# Altium project RK3576J-MB.PrjPCB (part 5 of 7)

## Sheet VIDEO.SchDoc
size 420 x 297 mm; SheetNumber: 18; SheetTotal: 32; DocumentTypeShort: Э3; DocumentInvertoryNumber: ㅤ
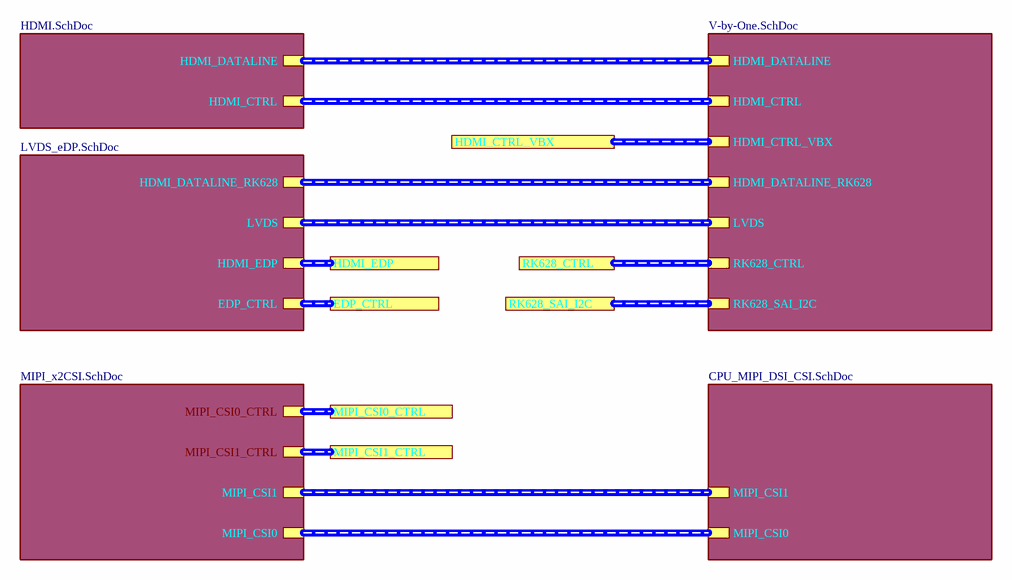
[diagram p14: VIDEO.SchDoc]

### Sub-sheets
CPU_MIPI_DSI_CSI = CPU_MIPI_DSI_CSI.SchDoc (file not in this document): MIPI_CSI1 (harness MIPI_CSI1), MIPI_CSI0 (harness MIPI_CSI0)
HDMI = HDMI.SchDoc: HDMI_DATALINE (harness HDMI_DATALINE), HDMI_CTRL (harness HDMI_CTRL)
LVDS_eDP = LVDS_eDP.SchDoc (file not in this document): LVDS (harness LVDS), HDMI_DATALINE_RK628 (harness HDMI_DATALINE_RK628), HDMI_EDP (harness HDMI_EDP), EDP_CTRL (harness EDP_CTRL)
MIPI_x2CSI = MIPI_x2CSI.SchDoc (file not in this document): MIPI_CSI1 (harness MIPI_CSI1), MIPI_CSI0 (harness MIPI_CSI0), MIPI_CSI0_CTRL (harness MIPI_CSI0_CTRL), MIPI_CSI1_CTRL (harness MIPI_CSI1_CTRL)
V-by-One.Sch = V-by-One.SchDoc (file not in this document): HDMI_CTRL (harness HDMI_CTRL), HDMI_DATALINE (harness HDMI_DATALINE), HDMI_CTRL_VBX (harness HDMI_CTRL_VBX), LVDS (harness LVDS), HDMI_DATALINE_RK628 (harness HDMI_DATALINE_RK628), RK628_SAI_I2C (harness RK628_SAI_I2C), RK628_CTRL (harness RK628_CTRL)

### Ports
EDP_CTRL, HDMI_CTRL_VBX, HDMI_EDP, MIPI_CSI0_CTRL, MIPI_CSI1_CTRL, RK628_CTRL, RK628_SAI_I2C

### Buses and harness runs
harness port EDP_CTRL = sheet LVDS_eDP/EDP_CTRL
harness port HDMI_CTRL_VBX = sheet V-by-One.Sch/HDMI_CTRL_VBX
harness port HDMI_EDP = sheet LVDS_eDP/HDMI_EDP
harness port MIPI_CSI0_CTRL = sheet MIPI_x2CSI/MIPI_CSI0_CTRL
harness port MIPI_CSI1_CTRL = sheet MIPI_x2CSI/MIPI_CSI1_CTRL
harness port RK628_CTRL = sheet V-by-One.Sch/RK628_CTRL
harness port RK628_SAI_I2C = sheet V-by-One.Sch/RK628_SAI_I2C
harness sheet CPU_MIPI_DSI_CSI/MIPI_CSI0 = sheet MIPI_x2CSI/MIPI_CSI0
harness sheet CPU_MIPI_DSI_CSI/MIPI_CSI1 = sheet MIPI_x2CSI/MIPI_CSI1
harness sheet HDMI/HDMI_CTRL = sheet V-by-One.Sch/HDMI_CTRL
harness sheet HDMI/HDMI_DATALINE = sheet V-by-One.Sch/HDMI_DATALINE
harness sheet LVDS_eDP/HDMI_DATALINE_RK628 = sheet V-by-One.Sch/HDMI_DATALINE_RK628
harness sheet LVDS_eDP/LVDS = sheet V-by-One.Sch/LVDS

### Notes on the sheet
- Подп. и дата
- Инв. № дубл.
- Взам. инв. №
- Инв. № подл.
- Изм.
- Лист
- № докум.
- Подп.
- Дата
- Копировал
- Формат А3

## Sheet HDMI.SchDoc
size 420 x 297 mm; Scale: 1:1; DocumentType: Схема электрическая принципиальная; SheetNumber: 19; SheetTotal: 32; DocumentTypeShort: Э3; DocumentInvertoryNumber: ㅤ
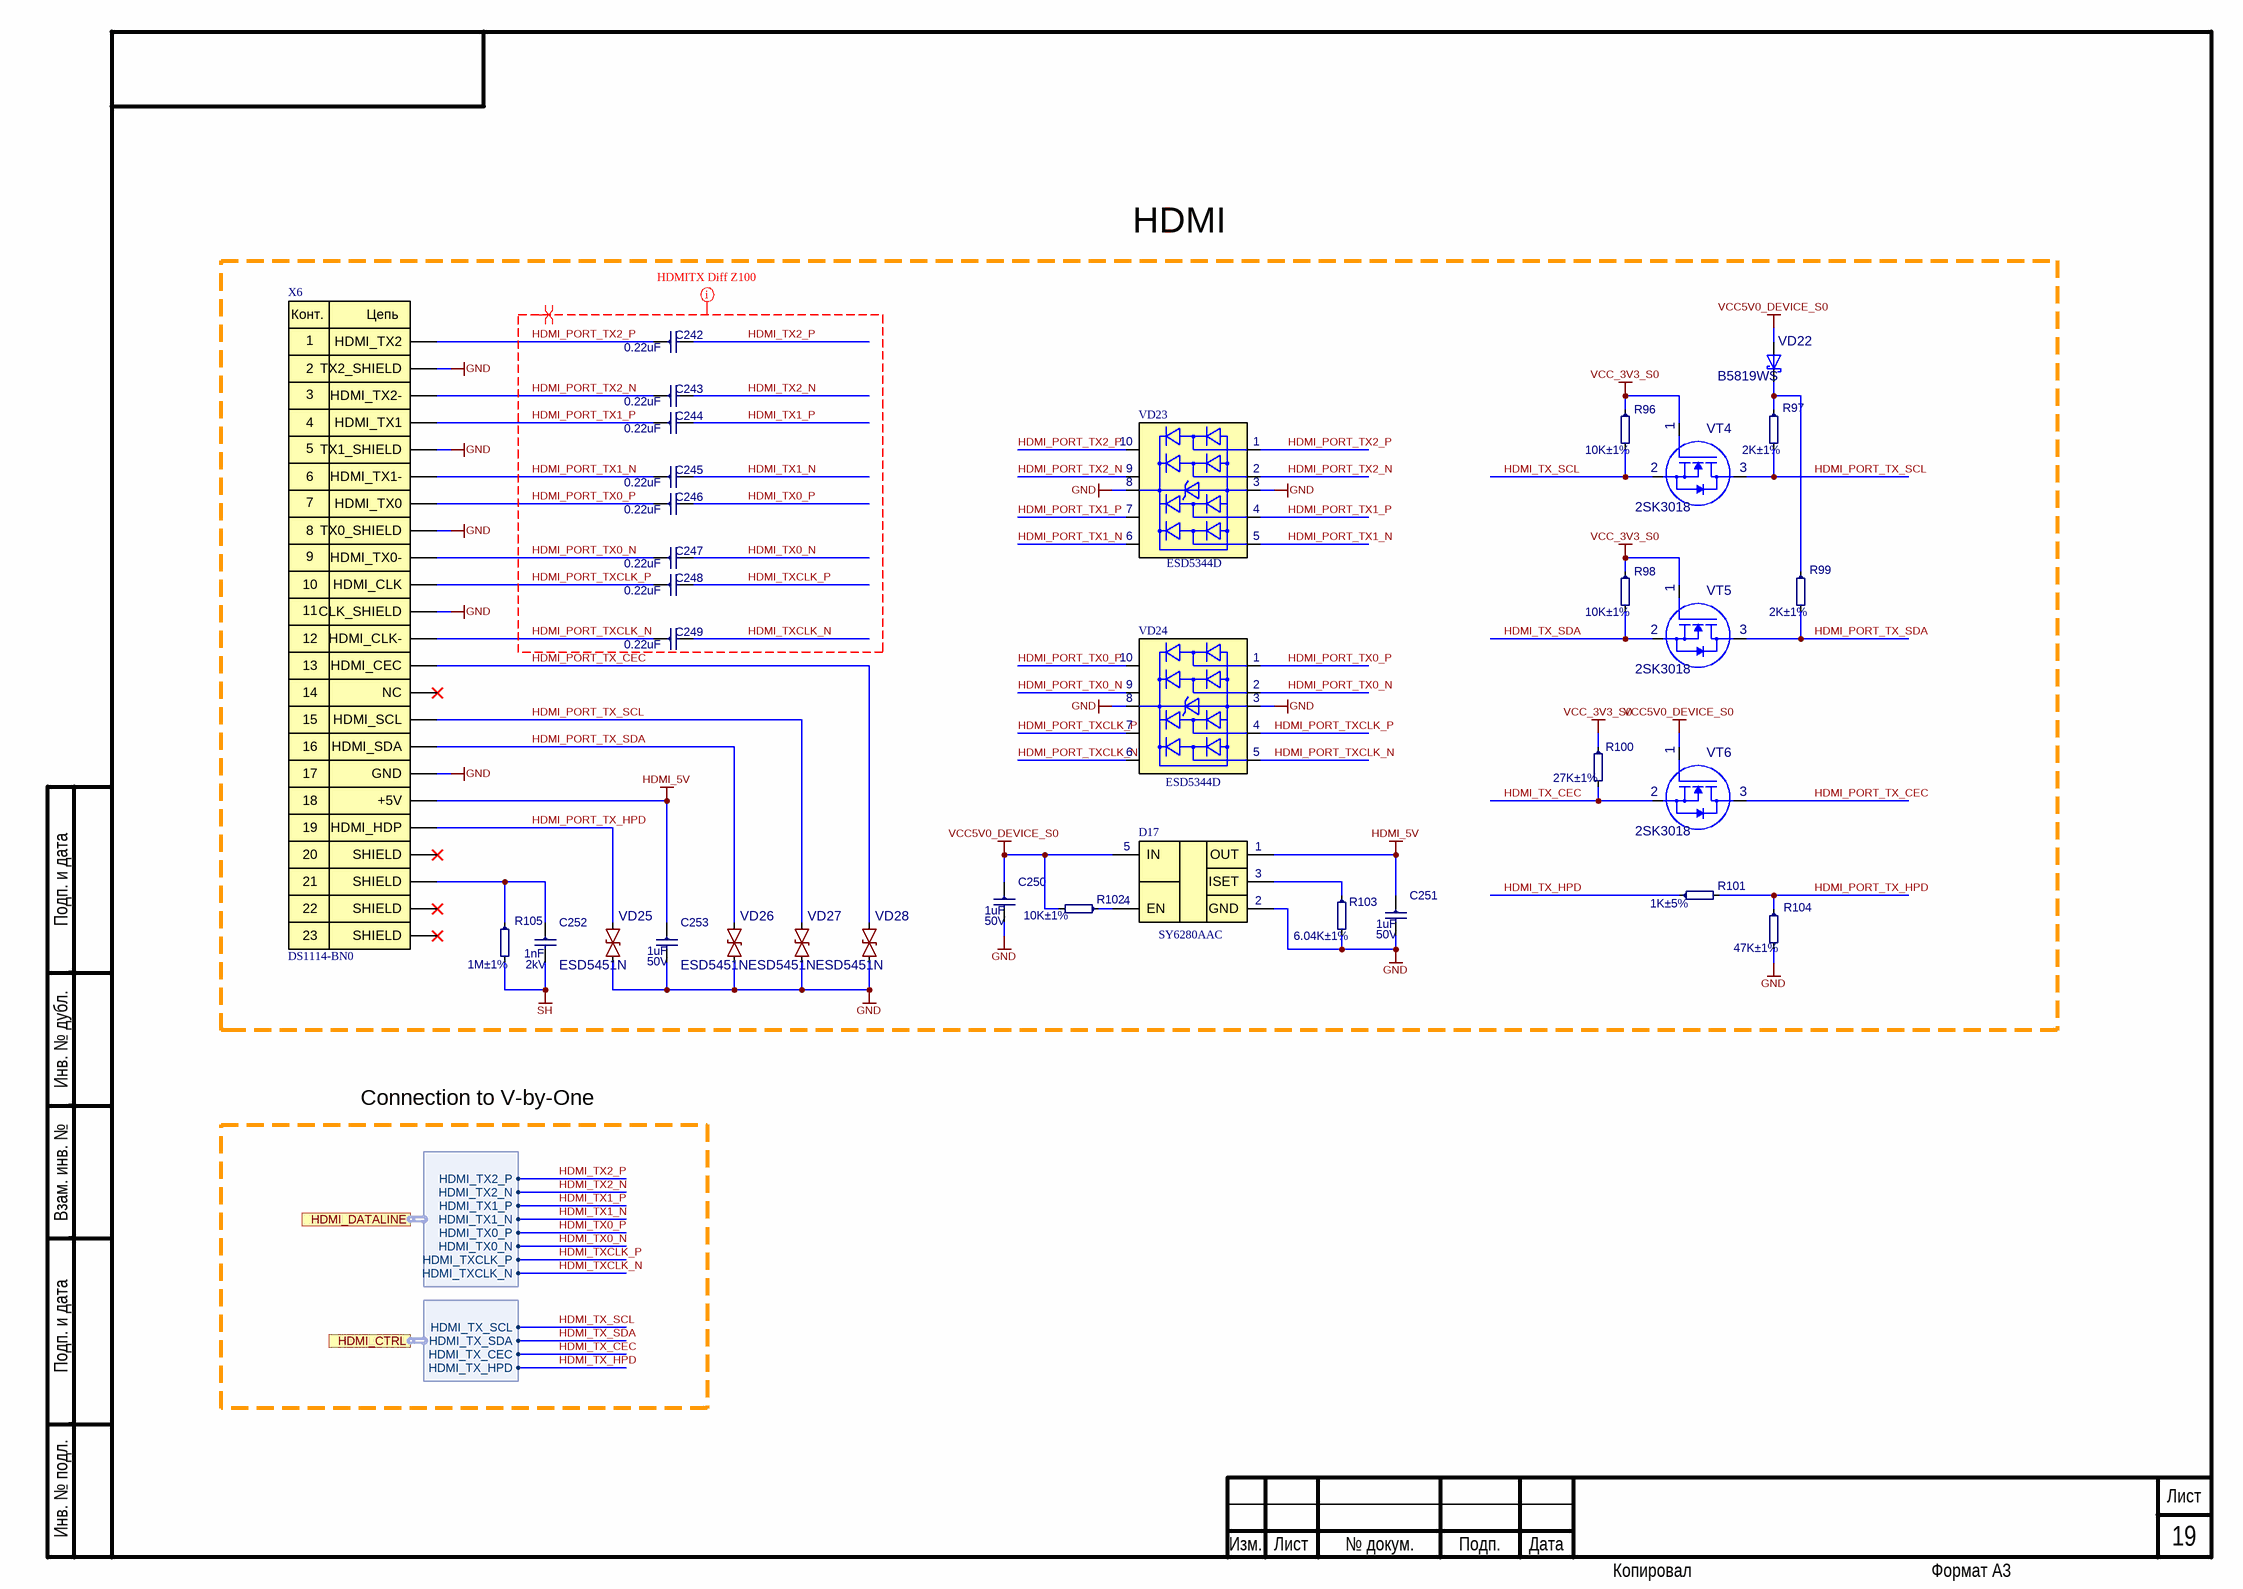
[diagram p15: HDMI.SchDoc]

### Parts
C242  0.22uF  [C0201]
C243  0.22uF  [C0201]
C244  0.22uF  [C0201]
C245  0.22uF  [C0201]
C246  0.22uF  [C0201]
C247  0.22uF  [C0201]
C248  0.22uF  [C0201]
C249  0.22uF  [C0201]
C250  1uF  Voltage: 50V  [C0402]
C251  1uF  Voltage: 50V  [C0402]
C252  1nF  Voltage: 2kV  [C1812]
C253  1uF  Voltage: 50V  [C0402]
D17  SY6280AAC  [SY6280AAC]
R96  10K±1%  [R0402]
R97  2K±1%  [R0402]
R98  10K±1%  [R0402]
R99  2K±1%  [R0402]
R100  27K±1%  [R0402]
R101  1K±5%  [R0402]
R102  10K±1%  [R0402]
R103  6.04K±1%  [R0402]
R104  47K±1%  [R0402]
R105  1M±1%  [R1206]
VD22  B5819WS  [B5819WS]
VD23  ESD5344D  [ESD5344D]
VD24  ESD5344D  [ESD5344D]
VD25  ESD5451N  [DFN_1006_2]
VD26  ESD5451N  [DFN_1006_2]
VD27  ESD5451N  [DFN_1006_2]
VD28  ESD5451N  [DFN_1006_2]
VT4  2SK3018  [2SK3018]
VT5  2SK3018  [2SK3018]
VT6  2SK3018  [2SK3018]
X6  DS1114-BN0  [DS1114-BN0]

### Ports
HDMI_CTRL (harness HDMI_CTRL), HDMI_DATALINE (harness HDMI_DATALINE)

### Harnesses
HDMI_DATALINE: HDMI_TX2_N, HDMI_TX1_P, HDMI_TX1_N, HDMI_TX2_P, HDMI_TX0_P, HDMI_TX0_N, HDMI_TXCLK_P, HDMI_TXCLK_N
HDMI_CTRL: HDMI_TX_SDA, HDMI_TX_CEC, HDMI_TX_HPD, HDMI_TX_SCL

### Nets
GND: C250.2 C251.2 C253.2 D17.2(GND) R103.2 R104.2 VD23.3 VD23.8 VD24.3 VD24.8 VD25.2 VD26.2 VD27.2 VD28.2 X6.2(TX2_SHIELD) X6.5(TX1_SHIELD) X6.8(TX0_SHIELD) X6.11(CLK_SHIELD) X6.17(GND)
HDMI_5V: C251.1 C253.1 D17.1(OUT) X6.18(+5V)
SH: C252.2 R105.2
VCC5V0_DEVICE_S0: C250.1 D17.5(IN) R102.2 VD22.2(A) VT6.1(G)
VCC_3V3_S0: R96.1 R98.1 R100.1 VT4.1(G) VT5.1(G)
HDMI_PORT_TX0_N: C247.1 VD24.2 VD24.9 X6.9(HDMI_TX0-)
HDMI_PORT_TX0_P: C246.1 VD24.1 VD24.10 X6.7(HDMI_TX0)
HDMI_PORT_TX1_N: C245.1 VD23.5 VD23.6 X6.6(HDMI_TX1-)
HDMI_PORT_TX1_P: C244.1 VD23.4 VD23.7 X6.4(HDMI_TX1)
HDMI_PORT_TX2_N: C243.1 VD23.2 VD23.9 X6.3(HDMI_TX2-)
HDMI_PORT_TX2_P: C242.1 VD23.1 VD23.10 X6.1(HDMI_TX2)
HDMI_PORT_TX_CEC: VD28.1 VT6.3(D) X6.13(HDMI_CEC)
HDMI_PORT_TX_HPD: R101.2 R104.1 VD25.1 X6.19(HDMI_HDP)
HDMI_PORT_TX_SCL: R97.2 VD27.1 VT4.3(D) X6.15(HDMI_SCL)
HDMI_PORT_TX_SDA: R99.2 VD26.1 VT5.3(D) X6.16(HDMI_SDA)
HDMI_PORT_TXCLK_N: C249.1 VD24.5 VD24.6 X6.12(HDMI_CLK-)
HDMI_PORT_TXCLK_P: C248.1 VD24.4 VD24.7 X6.10(HDMI_CLK)
HDMI_TX0_N: C247.2 ; port HDMI_DATALINE.HDMI_TX0_N
HDMI_TX0_P: C246.2 ; port HDMI_DATALINE.HDMI_TX0_P
HDMI_TX1_N: C245.2 ; port HDMI_DATALINE.HDMI_TX1_N
HDMI_TX1_P: C244.2 ; port HDMI_DATALINE.HDMI_TX1_P
HDMI_TX2_N: C243.2 ; port HDMI_DATALINE.HDMI_TX2_N
HDMI_TX2_P: C242.2 ; port HDMI_DATALINE.HDMI_TX2_P
HDMI_TX_CEC: R100.2 VT6.2(S) ; port HDMI_CTRL.HDMI_TX_CEC
HDMI_TX_HPD: R101.1 ; port HDMI_CTRL.HDMI_TX_HPD
HDMI_TX_SCL: R96.2 VT4.2(S) ; port HDMI_CTRL.HDMI_TX_SCL
HDMI_TX_SDA: R98.2 VT5.2(S) ; port HDMI_CTRL.HDMI_TX_SDA
HDMI_TXCLK_N: C249.2 ; port HDMI_DATALINE.HDMI_TXCLK_N
HDMI_TXCLK_P: C248.2 ; port HDMI_DATALINE.HDMI_TXCLK_P
NetC252_1: C252.1 R105.1 X6.21(SHIELD)
NetD17_3: D17.3(ISET) R103.1
NetD17_4: D17.4(EN) R102.1
NetR97_1: R97.1 R99.1 VD22.1(K)

Not connected (* = marked no-connect by the designer): X6 14(NC)* 20(SHIELD)* 22(SHIELD)* 23(SHIELD)*

### Layout directives
net class HDMITX: HDMI_PORT_TX0_N, HDMI_PORT_TX0_P, HDMI_PORT_TX1_N, HDMI_PORT_TX1_P, HDMI_PORT_TX2_N, HDMI_PORT_TX2_P, HDMI_PORT_TXCLK_N, HDMI_PORT_TXCLK_P, HDMI_TX0_N, HDMI_TX0_P, HDMI_TX1_N, HDMI_TX1_P, HDMI_TX2_N, HDMI_TX2_P, HDMI_TXCLK_N, HDMI_TXCLK_P
differential pair; differential pair class Diff_Z100: HDMI_PORT_TX0_N, HDMI_PORT_TX0_P, HDMI_PORT_TX1_N, HDMI_PORT_TX1_P, HDMI_PORT_TX2_N, HDMI_PORT_TX2_P, HDMI_PORT_TXCLK_N, HDMI_PORT_TXCLK_P, HDMI_TX0_N, HDMI_TX0_P, HDMI_TX1_N, HDMI_TX1_P, HDMI_TX2_N, HDMI_TX2_P, HDMI_TXCLK_N, HDMI_TXCLK_P

### Notes on the sheet
- HDMI
- Connection to V-by-One
- Подп. и дата
- Инв. № дубл.
- Взам. инв. №
- Инв. № подл.
- Изм.
- Лист
- № докум.
- Подп.
- Дата
- Копировал
- Формат А3
- (in symbol DS1114-BN0) Конт.; Цепь

### Library data of the parts
C242-C249 = 0201-C0G-25V-100pF±5%: *; Part Number: 0201-X5R-10V-220nF±10%; Manufacturer: Yageo; NameFromManufacturer: CC0201KRX5R6BB224; Dielectric: C0G; Voltage: 10V; Place: *); Tolerance: 5%; Check: False; Case: C0201; Value: 0.22uF; Temperature: -55°C~125°C; ComponentLink2Description: Link to datasheet; ComponentLink1Description: DATASHEET; ComponentLink2URL: https://ru.mouser.com/ProductDetail/YAGEO/CC0201JRNPO8BN101?qs=%2Fha2pyFaduhl6p6a7Jtfij5kOT7C0BCbN0eDEcSOi5wWtTVDmUsGTw%3D%3D; ComponentLink1URL: Datasheets/capacitors/UPY-GP_NP0_16V-to-50V_18.pdf; Last changed: 27.10.2022
C250 C251 C253 = 0402-X5R-50V-1uF±10%: Ceramic Capacitor 0402 1uF ±10% 50V X5R; Manufacturer: Yageo; NameFromManufacturer: CC0402KRX5R9BB105; Place: *); Check: False; Dielectric: X5R; Case: C0402; Part Number: 0402-X5R-50V-1uF±10%; Value: 1uF; Tolerance: 10%; Temperature: -55°C~85°C; ComponentLink2Description: Link to datasheet; ComponentLink1Description: DATASHEET; ComponentLink2URL: https://www.lcsc.com/product-detail/Multilayer-Ceramic-Capacitors-MLCC-SMD-SMT_YAGEO-CC0402KRX5R9BB105_C7500380.html; Last changed: 09.04.2025
C252 = 1812-C0G-2kV-1uF±10%: *; Part Number: 1812-C0G-2kV-1nF±10%; Manufacturer: FH; NameFromManufacturer: 1812B102K202NT; Dielectric: C0G; Place: *); Tolerance: 5%; Check: False; Case: CASE; Value: 1nF; Temperature: -55°C~125°C; ComponentLink2Description: Link to datasheet; ComponentLink1Description: DATASHEET; ComponentLink2URL: https://octopart.com/1812ga102jat2a-avx-75165070?r=sp; ComponentLink1URL: Datasheets/capacitors/C0GNP0-Dielectric.pdf; Last changed: 27.10.2022
D17 = SY6280AAC: Power Distribution Switches; Manufacturer: Silergy Corp; Check: False; Part Number: SY6280AAC; NameFromManufacturer: SY6280AAC; Value: SY6280AAC; ComponentLink1Description: DATASHEET; Last changed: 24.03.2023
R96 R98 R102 = 0402-0.0625W-10K-100ppm±1%: as R2 on sheet IC_LPDDR4; Case: R0402; Part Number: 0402-0.0625W-10K-100ppm±1%; Tolerance: 1%; Temperature: -55°C~155°C; ComponentLink1Description: DATASHEET; ComponentLink1URL: https://ru.mouser.com/ProductDetail/YAGEO/RC0402FR-0710KL?qs=%2Fha2pyFaduhjtLcYvKXQ8IogF7YwN7YtH%252BOO8ZtEEMnoa4yoWYcwpw%3D%3D; Datasheet: Datasheets/resistors/PYu-RC_Group_51_RoHS_L_11.pdf; Last changed: 27.10.2022
R97 R99 = 0402-0.0625W-2K-100ppm±1%: NameFromManufacturer: RC0402FR-072KL; Manufacturer: Yageo; Place: *); Value: 2K; Tolerance: 1%; Check: False; Case: R0402; Part Number: 0402-0.0625W-2K-100ppm±1%; Temperature: -55°C~155°C; ComponentLink1Description: DATASHEET; ComponentLink1URL: https://ru.mouser.com/ProductDetail/YAGEO/RC0402FR-072KL?qs=%2Fha2pyFaduhjtLcYvKXQ8CqCkWjwqUqgtfrQweQcV7%252BeDonvCaUsqQ%3D%3D; Datasheet: Datasheets/resistors/PYu-RC_Group_51_RoHS_L_11.pdf; Last changed: 27.10.2022
R100 = 0402-0.0625W-27K-100ppm±1%: NameFromManufacturer: RC0402FR-0727KL; Manufacturer: Yageo; Place: *); Value: 27K; Tolerance: 1%; Check: False; Case: R0402; Part Number: 0402-0.0625W-27K-100ppm±1%; Temperature: -55°C~155°C; ComponentLink1Description: DATASHEET; ComponentLink1URL: https://eu.mouser.com/ProductDetail/YAGEO/RC0402FR-0727KL?qs=UOUeRUa%252B8Wnc61O5LQjN8Q%3D%3D; Datasheet: Datasheets/resistors/PYu-RC_Group_51_RoHS_L_11.pdf; Last changed: 27.10.2022
R101 = 0402-0.0625W-1K-100ppm±5%: NameFromManufacturer: RC0402JR-071KL; Manufacturer: Yageo; Place: *); Value: 1K; Tolerance: 5%; Check: False; Case: R0402; Part Number: 0402-0.0625W-1K-100ppm±5%; Temperature: -55°C~155°C; ComponentLink1Description: DATASHEET; ComponentLink1URL: https://ru.mouser.com/ProductDetail/YAGEO/RC0402JR-071KL?qs=%2Fha2pyFadugNN0LzwXn2qBG%2Fxv0pCy6gh7Z%252B1hZJT2CnjLeHVORGDQ%3D%3D; Datasheet: Datasheets/resistors/PYu-RC_Group_51_RoHS_L_11.pdf; Last changed: 27.10.2022
R103 = 0402-0.0625W-6.04K-100ppm±1%: NameFromManufacturer: RC0402FR-076K04L; Manufacturer: Yageo; Place: *); Value: 6.04K; Tolerance: 1%; Check: False; Case: R0402; Part Number: 0402-0.0625W-6.04K-100ppm±1%; Temperature: -55°C~155°C; ComponentLink1Description: DATASHEET; ComponentLink1URL: https://www.electronshik.ru/item/YAG/RC0402FR-076K04L; Datasheet: Datasheets/resistors/PYu-RC_Group_51_RoHS_L_11.pdf; Last changed: 18.11.2022
R104 = 0402-0.0625W-47K-100ppm±1%: NameFromManufacturer: RC0402FR-0747KL; Manufacturer: Yageo; Place: *); Value: 47K; Tolerance: 1%; Check: False; Case: R0402; Part Number: 0402-0.0625W-47K-100ppm±1%; Temperature: -55°C~155°C; ComponentLink1Description: DATASHEET; ComponentLink1URL: https://www.terraelectronica.ru/pdf/show?pdf_file=%252Fds%252Fpdf%252FR%252FRC0402.pdf; Datasheet: Datasheets/resistors/PYu-RC_Group_51_RoHS_L_12.pdf; Last changed: 27.10.2022
R105 = 1206-0.25W-1M-100ppm±1%: Chip Resistor 1206 1MΩ ±1% 200V ±100ppm/℃ Thick Film; NameFromManufacturer: RC1206FR-071ML; Manufacturer: Yageo; Place: *); Value: 1M; Check: False; Case: R1206; Part Number: 1206-0.25W-1M-100ppm±1%; Tolerance: 1%; Temperature: -55°C~155°C; ComponentLink1Description: DATASHEET; ComponentLink1URL: https://www.lcsc.com/product-detail/Chip-Resistor-Surface-Mount_YAGEO-RC1206FR-071ML_C108083.html?s_z=n_RC1206FR-071ML; Last changed: 09.04.2025
VD22 = B5819WS: Manufacturer: MDD; Check: False; Part Number: B5819WS; Value: B5819WS; NameFromManufacturer: B5819WS
VD23 VD24 = ESD5344D: Manufacturer: KUU; Check: False; Part Number: ESD5344D; Value: ESD5344D; NameFromManufacturer: ESD5344D
VD25-VD28 = ESD5451N: Bidirectional TVS Diode 5V; Manufacturer: Tech Public Co.; Place: *); Check: False; Part Number: ESD5451N; Value: ESD5451N; Temperature: -65°C~150°C; ComponentLink1Description: DATASHEET; NameFromManufacturer: ESD5451N; Last changed: 13.04.2023
VT4-VT6 = 2SK3018: N-Channel; Manufacturer: KUU; Check: False; Part Number: 2SK3018; Value: 2SK3018; NameFromManufacturer: 2SK3018
X6 = DS1114-BN0: Manufacturer: CONNFLY; Check: False; Part Number: DS1114-BN0; NameFromManufacturer: DS1114-BN0; Value: DS1114-BN0

## Sheet EXTENSIONS.SchDoc
size 420 x 297 mm; SheetNumber: 24; SheetTotal: 32; DocumentTypeShort: Э3; DocumentInvertoryNumber: ㅤ
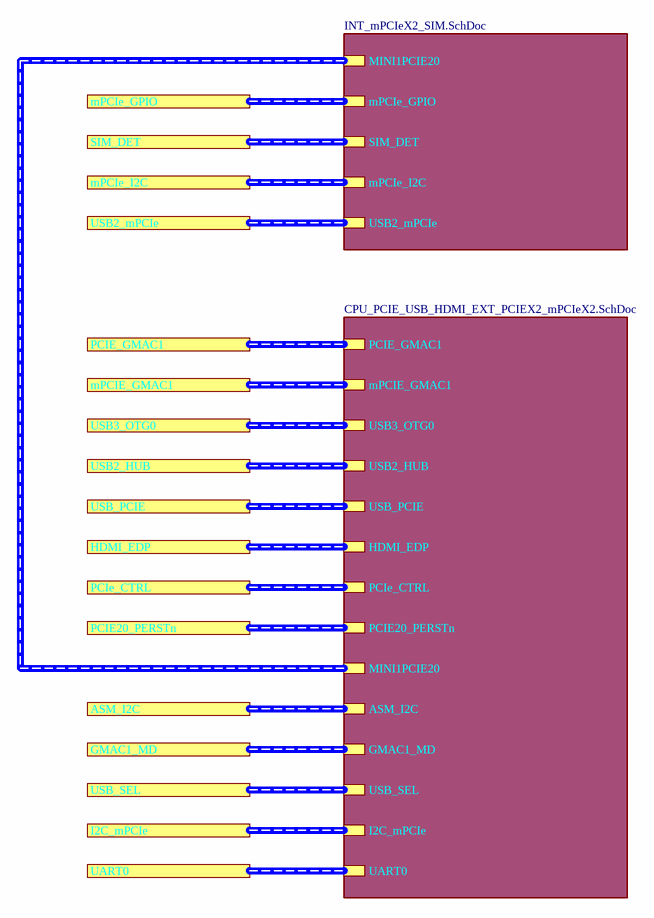
[diagram p16: EXTENSIONS.SchDoc]

### Sub-sheets
CPU_PCIE_USB_HDMI_EXT_PCIEX2_mPCIeX2 = CPU_PCIE_USB_HDMI_EXT_PCIEX2_mPCIeX2.SchDoc (file not in this document): PCIE_GMAC1 (harness PCIE_GMAC1), mPCIE_GMAC1 (harness mPCIE_GMAC1), USB3_OTG0 (harness USB3_OTG0), USB2_HUB (harness USB2_HUB), USB_PCIE (harness USB_PCIE), PCIe_CTRL (harness PCIe_CTRL), MINI1PCIE20 (harness MINI1PCIE20), HDMI_EDP (harness HDMI_EDP), ASM_I2C (harness ASM_I2C), GMAC1_MD (harness GMAC1_MD), PCIE20_PERSTn (harness PCIE20_PERSTn), USB_SEL (harness USB_SEL), I2C_mPCIe (harness I2C_mPCIe), UART0 (harness UART0)
INT_mPCIeX2_SIM = INT_mPCIeX2_SIM.SchDoc (file not in this document): mPCIe_GPIO (harness mPCIe_GPIO), SIM_DET (harness SIM_DET), mPCIe_I2C (harness mPCIe_I2C), USB2_mPCIe (harness USB2_mPCIe), MINI1PCIE20 (harness MINI1PCIE20)

### Ports
ASM_I2C, GMAC1_MD, HDMI_EDP, I2C_mPCIe, mPCIE_GMAC1, mPCIe_GPIO, mPCIe_I2C, PCIE20_PERSTn, PCIe_CTRL, PCIE_GMAC1, SIM_DET, UART0, USB2_HUB, USB2_mPCIe, USB3_OTG0, USB_PCIE, USB_SEL

### Buses and harness runs
harness port ASM_I2C = sheet CPU_PCIE_USB_HDMI_EXT_PCIEX2_mPCIeX2/ASM_I2C
harness port GMAC1_MD = sheet CPU_PCIE_USB_HDMI_EXT_PCIEX2_mPCIeX2/GMAC1_MD
harness port HDMI_EDP = sheet CPU_PCIE_USB_HDMI_EXT_PCIEX2_mPCIeX2/HDMI_EDP
harness port I2C_mPCIe = sheet CPU_PCIE_USB_HDMI_EXT_PCIEX2_mPCIeX2/I2C_mPCIe
harness port mPCIE_GMAC1 = sheet CPU_PCIE_USB_HDMI_EXT_PCIEX2_mPCIeX2/mPCIE_GMAC1
harness port mPCIe_GPIO = sheet INT_mPCIeX2_SIM/mPCIe_GPIO
harness port mPCIe_I2C = sheet INT_mPCIeX2_SIM/mPCIe_I2C
harness port PCIE20_PERSTn = sheet CPU_PCIE_USB_HDMI_EXT_PCIEX2_mPCIeX2/PCIE20_PERSTn
harness port PCIe_CTRL = sheet CPU_PCIE_USB_HDMI_EXT_PCIEX2_mPCIeX2/PCIe_CTRL
harness port PCIE_GMAC1 = sheet CPU_PCIE_USB_HDMI_EXT_PCIEX2_mPCIeX2/PCIE_GMAC1
harness port SIM_DET = sheet INT_mPCIeX2_SIM/SIM_DET
harness port UART0 = sheet CPU_PCIE_USB_HDMI_EXT_PCIEX2_mPCIeX2/UART0
harness port USB2_HUB = sheet CPU_PCIE_USB_HDMI_EXT_PCIEX2_mPCIeX2/USB2_HUB
harness port USB2_mPCIe = sheet INT_mPCIeX2_SIM/USB2_mPCIe
harness port USB3_OTG0 = sheet CPU_PCIE_USB_HDMI_EXT_PCIEX2_mPCIeX2/USB3_OTG0
harness port USB_PCIE = sheet CPU_PCIE_USB_HDMI_EXT_PCIEX2_mPCIeX2/USB_PCIE
harness port USB_SEL = sheet CPU_PCIE_USB_HDMI_EXT_PCIEX2_mPCIeX2/USB_SEL
harness sheet CPU_PCIE_USB_HDMI_EXT_PCIEX2_mPCIeX2/MINI1PCIE20 = sheet INT_mPCIeX2_SIM/MINI1PCIE20

### Notes on the sheet
- Подп. и дата
- Инв. № дубл.
- Взам. инв. №
- Инв. № подл.
- Изм.
- Лист
- № докум.
- Подп.
- Дата
- Копировал
- Формат А3

## Sheet USB.SchDoc
size 420 x 297 mm; Scale: 1:1; DocumentType: Схема электрическая принципиальная; SheetNumber: 28; SheetTotal: 32; DocumentTypeShort: Э3; DocumentInvertoryNumber: ㅤ
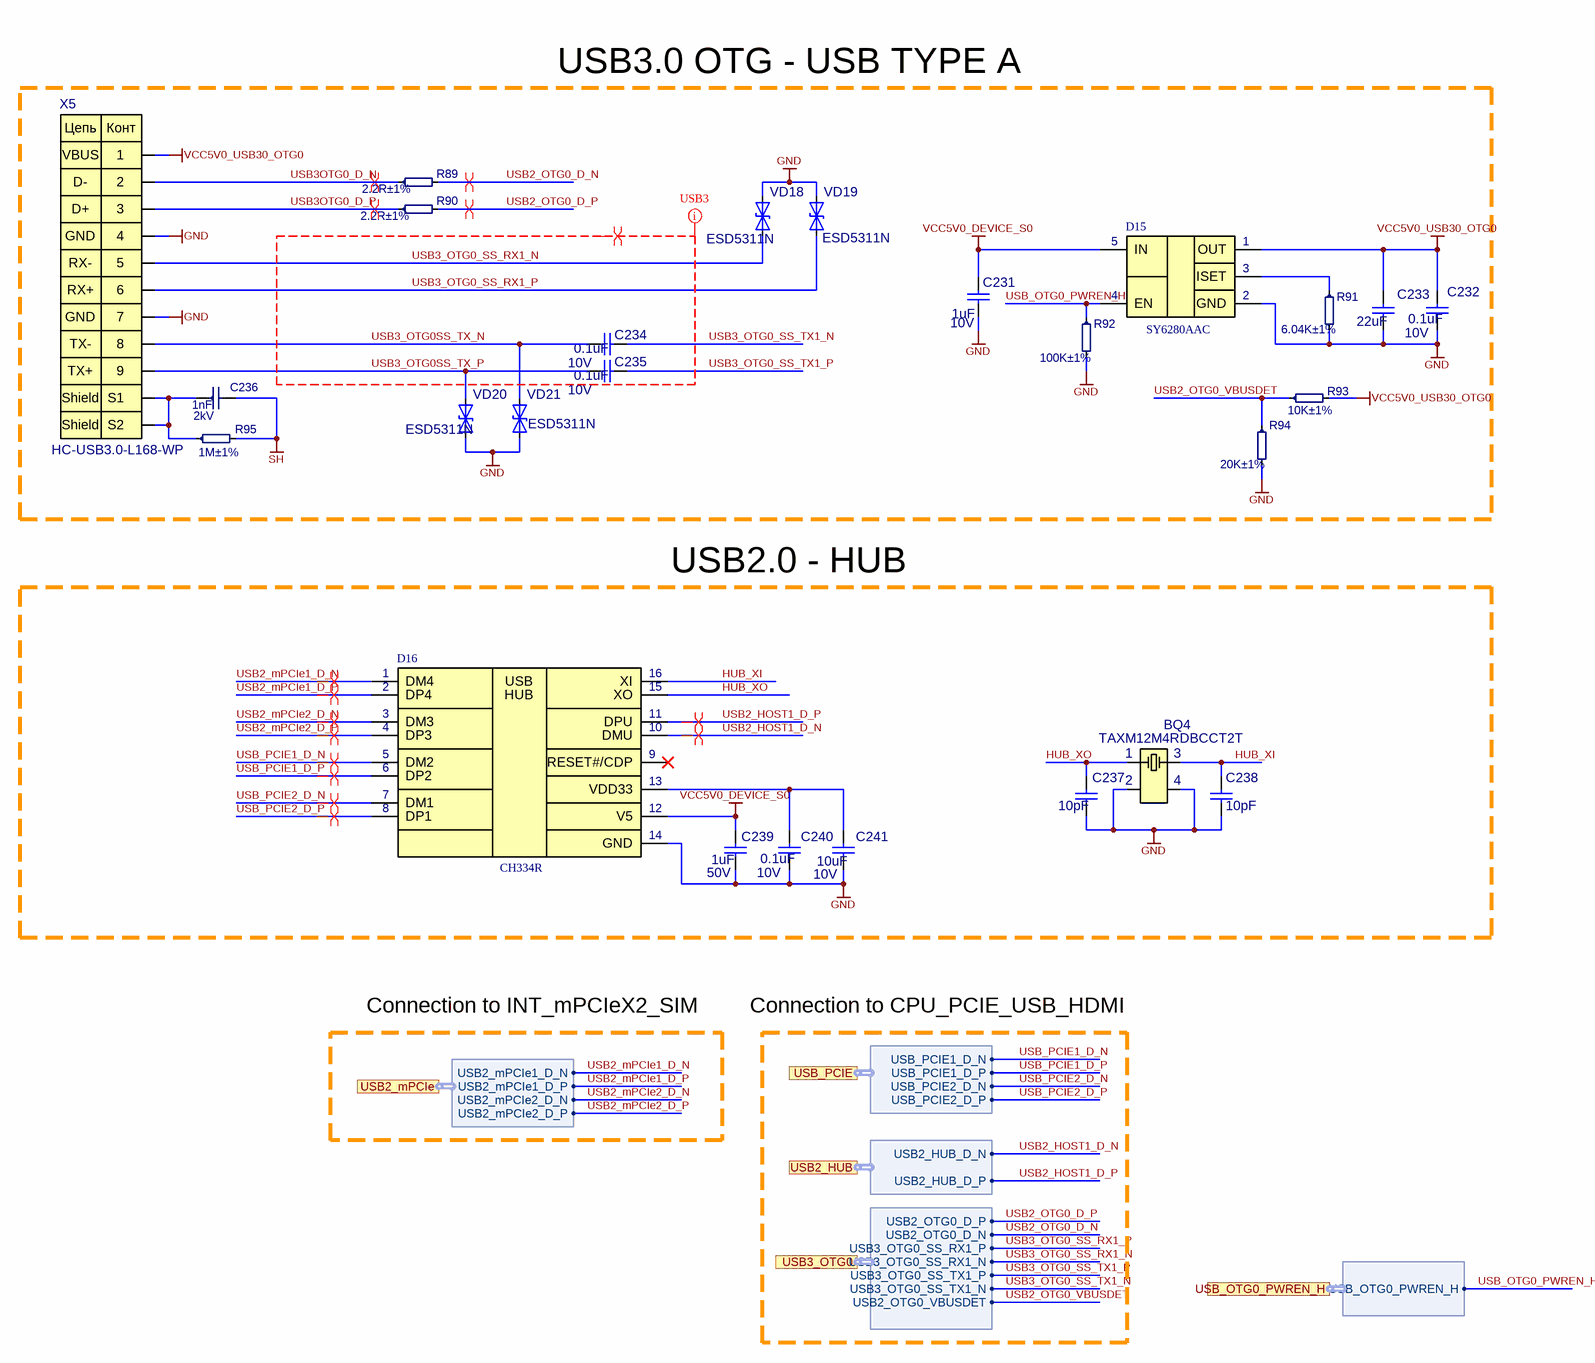
[diagram p17: USB.SchDoc]

### Parts
BQ4  TAXM12M4RDBCCT2T  [XC32M4-12.000-F10NNFT]
C231  1uF  Voltage: 10V  [C0402]
C232  0.1uF  Voltage: 10V  [C0402]
C233  22uF  [C0603]
C234  0.1uF  Voltage: 10V  [C0402]
C235  0.1uF  Voltage: 10V  [C0402]
C236  1nF  Voltage: 2kV  [C1812]
C237  10pF  [C0402]
C238  10pF  [C0402]
C239  1uF  Voltage: 50V  [C0603]
C240  0.1uF  Voltage: 10V  [C0402]
C241  10uF  Voltage: 10V  [C0402]
D15  SY6280AAC  [SY6280AAC]
D16  CH334R  [CH334R]
R89  2.2R±1%  [R0402]
R90  2.2R±1%  [R0402]
R91  6.04K±1%  [R0402]
R92  100K±1%  [R0402]
R93  10K±1%  [R0402]
R94  20K±1%  [R0402]
R95  1M±1%  [R1206]
VD18  ESD5311N  [ESD5311N]
VD19  ESD5311N  [ESD5311N]
VD20  ESD5311N  [ESD5311N]
VD21  ESD5311N  [ESD5311N]
X5  HC-USB3.0-L168-WP  [DS1095-05]

### Ports
USB2_HUB (harness USB2_HUB), USB2_mPCIe (harness USB2_mPCIe), USB3_OTG0 (harness USB3_OTG0), USB_OTG0_PWREN_H (harness USB_OTG0_PWREN_H), USB_PCIE (harness USB_PCIE)

### Harnesses
USB2_mPCIe: USB2_mPCIe1_D_P, USB2_mPCIe1_D_N, USB2_mPCIe2_D_P, USB2_mPCIe2_D_N
USB3_OTG0: USB3_OTG0_SS_RX1_P, USB3_OTG0_SS_RX1_N, USB3_OTG0_SS_TX1_P, USB2_OTG0_D_N, USB3_OTG0_SS_TX1_N, USB2_OTG0_VBUSDET, USB2_OTG0_D_P
USB2_HUB: USB2_HUB_D_P, USB2_HUB_D_N
USB_PCIE: USB_PCIE1_D_P, USB_PCIE1_D_N, USB_PCIE2_D_P, USB_PCIE2_D_N
USB_OTG0_PWREN_H: USB_OTG0_PWREN_H

### Nets
GND: BQ4.2 BQ4.4 C231.1 C232.2 C233.1 C237.1 C238.1 C239.1 C240.2 C241.1 D15.2(GND) D16.14(GND) R91.2 R92.2 R94.2 VD18.2 VD19.2 VD20.1 VD21.1 X5.4 X5.7
SH: C236.2 R95.2
VCC5V0_DEVICE_S0: C231.2 C239.2 D15.5(IN) D16.12(V5)
VCC5V0_USB30_OTG0: C232.1 C233.2 D15.1(OUT) R93.2 X5.1
HUB_XI: BQ4.3 C238.2 D16.16(XI)
HUB_XO: BQ4.1 C237.2 D16.15(XO)
USB2_HOST1_D_N: D16.10(DMU) ; port USB2_HUB.USB2_HUB_D_N
USB2_HOST1_D_P: D16.11(DPU) ; port USB2_HUB.USB2_HUB_D_P
USB2_mPCIe1_D_N: D16.1(DM4) ; port USB2_mPCIe.USB2_mPCIe1_D_N  [project net USB2_mPCIe.USB2_mPCIe1_D_N]
USB2_mPCIe1_D_P: D16.2(DP4) ; port USB2_mPCIe.USB2_mPCIe1_D_P  [project net USB2_mPCIe.USB2_mPCIe1_D_P]
USB2_mPCIe2_D_N: D16.3(DM3) ; port USB2_mPCIe.USB2_mPCIe2_D_N  [project net USB2_mPCIe.USB2_mPCIe2_D_N]
USB2_mPCIe2_D_P: D16.4(DP3) ; port USB2_mPCIe.USB2_mPCIe2_D_P  [project net USB2_mPCIe.USB2_mPCIe2_D_P]
USB2_OTG0_D_N: R89.2 ; port USB3_OTG0.USB2_OTG0_D_N
USB2_OTG0_D_P: R90.2 ; port USB3_OTG0.USB2_OTG0_D_P
USB2_OTG0_VBUSDET: R93.1 R94.1 ; port USB3_OTG0.USB2_OTG0_VBUSDET
USB3_OTG0_SS_RX1_N: VD18.1 X5.5 ; port USB3_OTG0.USB3_OTG0_SS_RX1_N  [project net USB3_OTG0.USB3_OTG0_SS_RX1_N]
USB3_OTG0_SS_RX1_P: VD19.1 X5.6 ; port USB3_OTG0.USB3_OTG0_SS_RX1_P  [project net USB3_OTG0.USB3_OTG0_SS_RX1_P]
USB3_OTG0_SS_TX1_N: C234.1 ; port USB3_OTG0.USB3_OTG0_SS_TX1_N  [project net USB3_OTG0.USB3_OTG0_SS_TX1_N]
USB3_OTG0_SS_TX1_P: C235.1 ; port USB3_OTG0.USB3_OTG0_SS_TX1_P  [project net USB3_OTG0.USB3_OTG0_SS_TX1_P]
USB3_OTG0SS_TX_N: C234.2 VD21.2 X5.8
USB3_OTG0SS_TX_P: C235.2 VD20.2 X5.9
USB3OTG0_D_N: R89.1 X5.2
USB3OTG0_D_P: R90.1 X5.3
USB_OTG0_PWREN_H: D15.4(EN) R92.1 ; port USB_OTG0_PWREN_H.USB_OTG0_PWREN_H
USB_PCIE1_D_N: D16.5(DM2) ; port USB_PCIE.USB_PCIE1_D_N  [project net USB_PCIE.USB_PCIE1_D_N]
USB_PCIE1_D_P: D16.6(DP2) ; port USB_PCIE.USB_PCIE1_D_P  [project net USB_PCIE.USB_PCIE1_D_P]
USB_PCIE2_D_N: D16.7(DM1) ; port USB_PCIE.USB_PCIE2_D_N  [project net USB_PCIE.USB_PCIE2_D_N]
USB_PCIE2_D_P: D16.8(DP1) ; port USB_PCIE.USB_PCIE2_D_P  [project net USB_PCIE.USB_PCIE2_D_P]
NetC236_1: C236.1 R95.1 X5.S1 X5.S2
NetC240_1: C240.1 C241.2 D16.13(VDD33)
NetD15_3: D15.3(ISET) R91.1

Not connected (* = marked no-connect by the designer): D16 9(RESET#/CDP)*

### Layout directives
net class USB3: USB3_OTG0_SS_RX1_N, USB3_OTG0_SS_RX1_P, USB3_OTG0SS_TX_N, USB3_OTG0SS_TX_P
differential pair; differential pair class Diff_Z90: USB2_HOST1_D_N, USB2_HOST1_D_P, USB2_mPCIe.USB2_mPCIe1_D_N, USB2_mPCIe.USB2_mPCIe1_D_P, USB2_mPCIe.USB2_mPCIe2_D_N, USB2_mPCIe.USB2_mPCIe2_D_P, USB2_OTG0_D_N, USB2_OTG0_D_P, USB3_OTG0_SS_RX1_N, USB3_OTG0_SS_RX1_P, USB3_OTG0SS_TX_N, USB3_OTG0SS_TX_P, USB3OTG0_D_N, USB3OTG0_D_P, USB_PCIE.USB_PCIE1_D_N, USB_PCIE.USB_PCIE1_D_P, USB_PCIE.USB_PCIE2_D_N, USB_PCIE.USB_PCIE2_D_P

### Notes on the sheet
- USB3.0 OTG - USB TYPE A
- (near X5) VBUS
- D-
- D+
- (near X5) GND
- (near X5) RX-
- (near X5) RX+
- (near X5) TX-
- (near X5) TX+
- USB2.0 - HUB
- Connection to INT_mPCIeX2_SIM
- Connection to CPU_PCIE_USB_HDMI
- Подп. и дата
- Инв. № дубл.
- Взам. инв. №
- Инв. № подл.
- Изм.
- Лист
- № докум.
- Подп.
- Дата
- Копировал
- Формат А3
- (in symbol CH334R) USB; HUB
- (in symbol DS1095-05) Цепь; Конт; Shield

### Library data of the parts
BQ4 = XC32M4-12.000-F10NNFT: 12MHz 10pF ±10ppm SMD3225-4P; Manufacturer: TAE; Check: False; Part Number: TAXM12M4RDBCCT2T; Value: TAXM12M4RDBCCT2T; NameFromManufacturer: TAXM12M4RDBCCT2T
C231 = 0402-X5R-10V-1uF±10%: Manufacturer: Samsung; NameFromManufacturer: CL05A105KP5NNNC; Place: S; Tolerance: 10%; Check: False; Annotation: *; Param: *; Value: 1uF; Part Number: 0402-X5R-10V-1uF±10%; Temperature: -55°C~85°C; ComponentLink1Description: DATASHEET; ComponentLink1URL: https://datasheet.ciiva.com/15195/getdatasheetpartid-358390-15195630.pdf?src-supplier=Verical; Datasheet: #https://datasheet.ciiva.com/15195/getdatasheetpartid-358390-15195630.pdf?src-supplier=Verical#; Last changed: 04.04.2021; ClassName: MCU
C232 C234 C235 C240 = 0402-X7R-16V-0.1uF±10%: Part Number: 0402-X5R-10V-0.1uF±10%; Manufacturer: Yageo; NameFromManufacturer: CC0402KRX5R6BB104; Place: S; Tolerance: 10%; Check: False; Value: 0.1uF; Temperature: -55°C~125°C; ComponentLink2Description: Link to datasheet; ComponentLink1Description: DATASHEET; Last changed: 27.10.2022
C233 = 0603-X5R-10V-22uF±20%: *; Manufacturer: Samsung Electro-Mechanics; NameFromManufacturer: CL10A226MQ8NRNE; Place: S; Voltage: 10V; Tolerance: 20%; Check: False; Part Number: 0603-X5R-10V-22uF±20%; Value: 22uF; Temperature: -55°C~85°C; ComponentLink2Description: Link to datasheet; ComponentLink1Description: DATASHEET; ComponentLink2URL: https://www.lcsc.com/product-detail/Multilayer-Ceramic-Capacitors-MLCC-SMD-SMT_Samsung-Electro-Mechanics-CL10A226MQ8NRNE_C159801.html; ComponentLink1URL: Datasheets/capacitors/1810261912_Samsung-Electro-Mechanics-CL10A226MQ8NRNE_C159801.pdf#Datasheets/capacitors/1810261912_Samsung-Electro-Mechanics-CL10A226MQ8NRNE_C159801.pdf#; Last changed: 05.12.2022
C236 = 1812-C0G-2kV-1uF±10%: *; Part Number: 1812-C0G-2kV-1nF±10%; Manufacturer: FH; NameFromManufacturer: 1812B102K202NT; Dielectric: C0G; Place: *); Tolerance: 5%; Check: False; Case: CASE; Value: 1nF; Temperature: -55°C~125°C; ComponentLink2Description: Link to datasheet; ComponentLink1Description: DATASHEET; ComponentLink2URL: https://octopart.com/1812ga102jat2a-avx-75165070?r=sp; ComponentLink1URL: Datasheets/capacitors/C0GNP0-Dielectric.pdf; Last changed: 27.10.2022
C237 C238 = 0402-NP0-50V-10pF±5%: Manufacturer: Yageo; NameFromManufacturer: CC0402JRNPO9BN100; Place: S; Voltage: 50V; Tolerance: 5%; Check: False; Part Number: 0402-NP0-50V-10pF±5%; Value: 10pF; Temperature: -55°C~125°C; ComponentLink2Description: Link to datasheet; ComponentLink1Description: DATASHEET; ComponentLink2URL: https://www.terraelectronica.ru/pdf/show?pdf_file=%252Fds%252Fpdf%252FN%252Fnpo.pdf; ComponentLink1URL: Datasheets/capacitors/DOC012565825.pdf; Last changed: 27.10.2022
C239 = 0603-X5R-50V-1uF±10%: *; Manufacturer: Yageo; NameFromManufacturer: CC0603KRX5R9BB105; Place: S; Tolerance: 10%; Analog: GRM188R61H105KAALD; Check: False; Part Number: 0603-X5R-50V-1uF±10%; Value: 1uF; Temperature: -55°C~85°C; ComponentLink2Description: Link to datasheet; ComponentLink1Description: DATASHEET; ComponentLink2URL: https://ru.mouser.com/ProductDetail/YAGEO/CC0603KRX5R9BB105?qs=zEY9bCHj09dqHVk4sHIcjA%3D%3D; ComponentLink1URL: Datasheets/capacitors/UPY-GPHC_X5R_4V-to-50V_26.pdf; Last changed: 27.10.2022
C241 = 0402-X5R-10V-10uF±20%: *; Manufacturer: Murata Electronics; NameFromManufacturer: GRM155R61A106ME44; Place: S; Tolerance: 20%; Check: False; Part Number: 0402-X5R-10V-10uF±20%; Value: 10uF; Temperature: -55°C~85°C; ComponentLink2Description: Link to datasheet; ComponentLink1Description: DATASHEET; ComponentLink2URL: https://octopart.com/grm155r61a106me44d-murata-99357754?r=sp; ComponentLink1URL: Datasheets/capacitors/GRM155R61A106ME44D.pdf; Last changed: 27.10.2022
D15 = SY6280AAC: Power Distribution Switches; Manufacturer: Silergy Corp; Check: False; Part Number: SY6280AAC; NameFromManufacturer: SY6280AAC; Value: SY6280AAC; ComponentLink1Description: DATASHEET; Last changed: 24.03.2023
D16 = CH334R: 4-port USB2.0 high-speed HUB controller; Manufacturer: WCH; Check: False; Part Number: CH334R; NameFromManufacturer: CH334R; Value: CH334R
R89 R90 = 0402-0.0625W-2.21K-100ppm±1%: *; Part Number: 0402-0.0625W-2.2R-100ppm±1%; NameFromManufacturer: RC0402FR-072R2L; Manufacturer: Yageo; Place: *); Value: 2.2R; Tolerance: 1%; Check: False; Case: R0402; Temperature: -55°C~155°C; ComponentLink1Description: DATASHEET; ComponentLink1URL: https://www.electronshik.ru/item/YAG/RC0402FR-072K21L; Datasheet: Datasheets/resistors/PYu-RC_Group_51_RoHS_L_12.pdf; Last changed: 27.10.2022
R91 = 0402-0.0625W-6.04K-100ppm±1%: NameFromManufacturer: RC0402FR-076K04L; Manufacturer: Yageo; Place: *); Value: 6.04K; Tolerance: 1%; Check: False; Case: R0402; Part Number: 0402-0.0625W-6.04K-100ppm±1%; Temperature: -55°C~155°C; ComponentLink1Description: DATASHEET; ComponentLink1URL: https://www.electronshik.ru/item/YAG/RC0402FR-076K04L; Datasheet: Datasheets/resistors/PYu-RC_Group_51_RoHS_L_11.pdf; Last changed: 18.11.2022
R92 = 0402-0.0625W-100K-100ppm±1%: Chip Resistor 0402 100kΩ ±1% 50V ±100ppm/℃ Thick Film; NameFromManufacturer: RC0402FR-07100KL; Manufacturer: Yageo; Place: *); Value: 100K; Check: False; Case: R0402; Part Number: 0402-0.0625W-100K-100ppm±1%; Tolerance: 1%; Temperature: -55°C~155°C; ComponentLink1Description: DATASHEET; ComponentLink1URL: https://www.yageo.com/upload/media/product/productsearch/datasheet/rchip/PYu-RC_Group_51_RoHS_L_11.pdf; Datasheet: Datasheets/resistors/PYu-RC_Group_51_RoHS_L_11.pdf; Last changed: 27.10.2022
R93 = 0402-0.0625W-10K-100ppm±1%: Chip Resistor 0402 10kΩ ±1% 50V ±100ppm/℃ Thick Film; NameFromManufacturer: RC0402FR-0710KL; Manufacturer: Yageo; Place: *); Value: 10K; Check: False; Case: R0402; Part Number: 0402-0.0625W-10K-100ppm±1%; Tolerance: 1%; Temperature: -55°C~155°C; ComponentLink1Description: DATASHEET; ComponentLink1URL: https://ru.mouser.com/ProductDetail/YAGEO/RC0402FR-0710KL?qs=%2Fha2pyFaduhjtLcYvKXQ8IogF7YwN7YtH%252BOO8ZtEEMnoa4yoWYcwpw%3D%3D; Datasheet: Datasheets/resistors/PYu-RC_Group_51_RoHS_L_11.pdf; Last changed: 27.10.2022
R94 = 0402-0.0625W-20K-100ppm±1%: Chip Resistor 0402 20kΩ ±1% 50V ±100ppm/℃ Thick Film; NameFromManufacturer: RC0402FR-0720KL; Manufacturer: Yageo; Place: *); Value: 20K; Check: False; Case: R0402; Part Number: 0402-0.0625W-20K-100ppm±1%; Tolerance: 1%; Temperature: -55°C~155°C; ComponentLink1Description: DATASHEET; ComponentLink1URL: https://www.terraelectronica.ru/product/506449; Datasheet: Datasheets/resistors/PYu-RC_Group_51_RoHS_L_11.pdf; Last changed: 27.10.2022
R95 = 1206-0.25W-1M-100ppm±1%: Chip Resistor 1206 1MΩ ±1% 200V ±100ppm/℃ Thick Film; NameFromManufacturer: RC1206FR-071ML; Manufacturer: Yageo; Place: *); Value: 1M; Check: False; Case: R1206; Part Number: 1206-0.25W-1M-100ppm±1%; Tolerance: 1%; Temperature: -55°C~155°C; ComponentLink1Description: DATASHEET; ComponentLink1URL: https://www.lcsc.com/product-detail/Chip-Resistor-Surface-Mount_YAGEO-RC1206FR-071ML_C108083.html?s_z=n_RC1206FR-071ML; Last changed: 09.04.2025
VD18-VD21 = ESD5311N: 1-Line, Bi-directional, Transient Voltage Suppressors.0.25pF.; Manufacturer: UMW; Check: False; Part Number: ESD5311N; Value: ESD5311N; NameFromManufacturer: ESD5311N
X5 = DS1095-05: USB type A, USB 3.0, right angle; Manufacturer: Hong Cheng; Place: *); Check: False; Part Number: HC-USB3.0-L168-WP; Value: HC-USB3.0-L168-WP; Temperature: -40°C~85°C; ComponentLink1Description: DATASHEET; NameFromManufacturer: HC-USB3.0-L168-WP; ComponentLink1URL: https://www.chipdip.ru/product/usb-3.0-a-ds1095-05; Last changed: 27.10.2022

## Sheet AUDIO.SchDoc
size 420 x 297 mm; Scale: 1:1; DocumentType: Схема электрическая принципиальная; SheetNumber: 27; SheetTotal: 32; DocumentTypeShort: Э3; DocumentInvertoryNumber: ㅤ
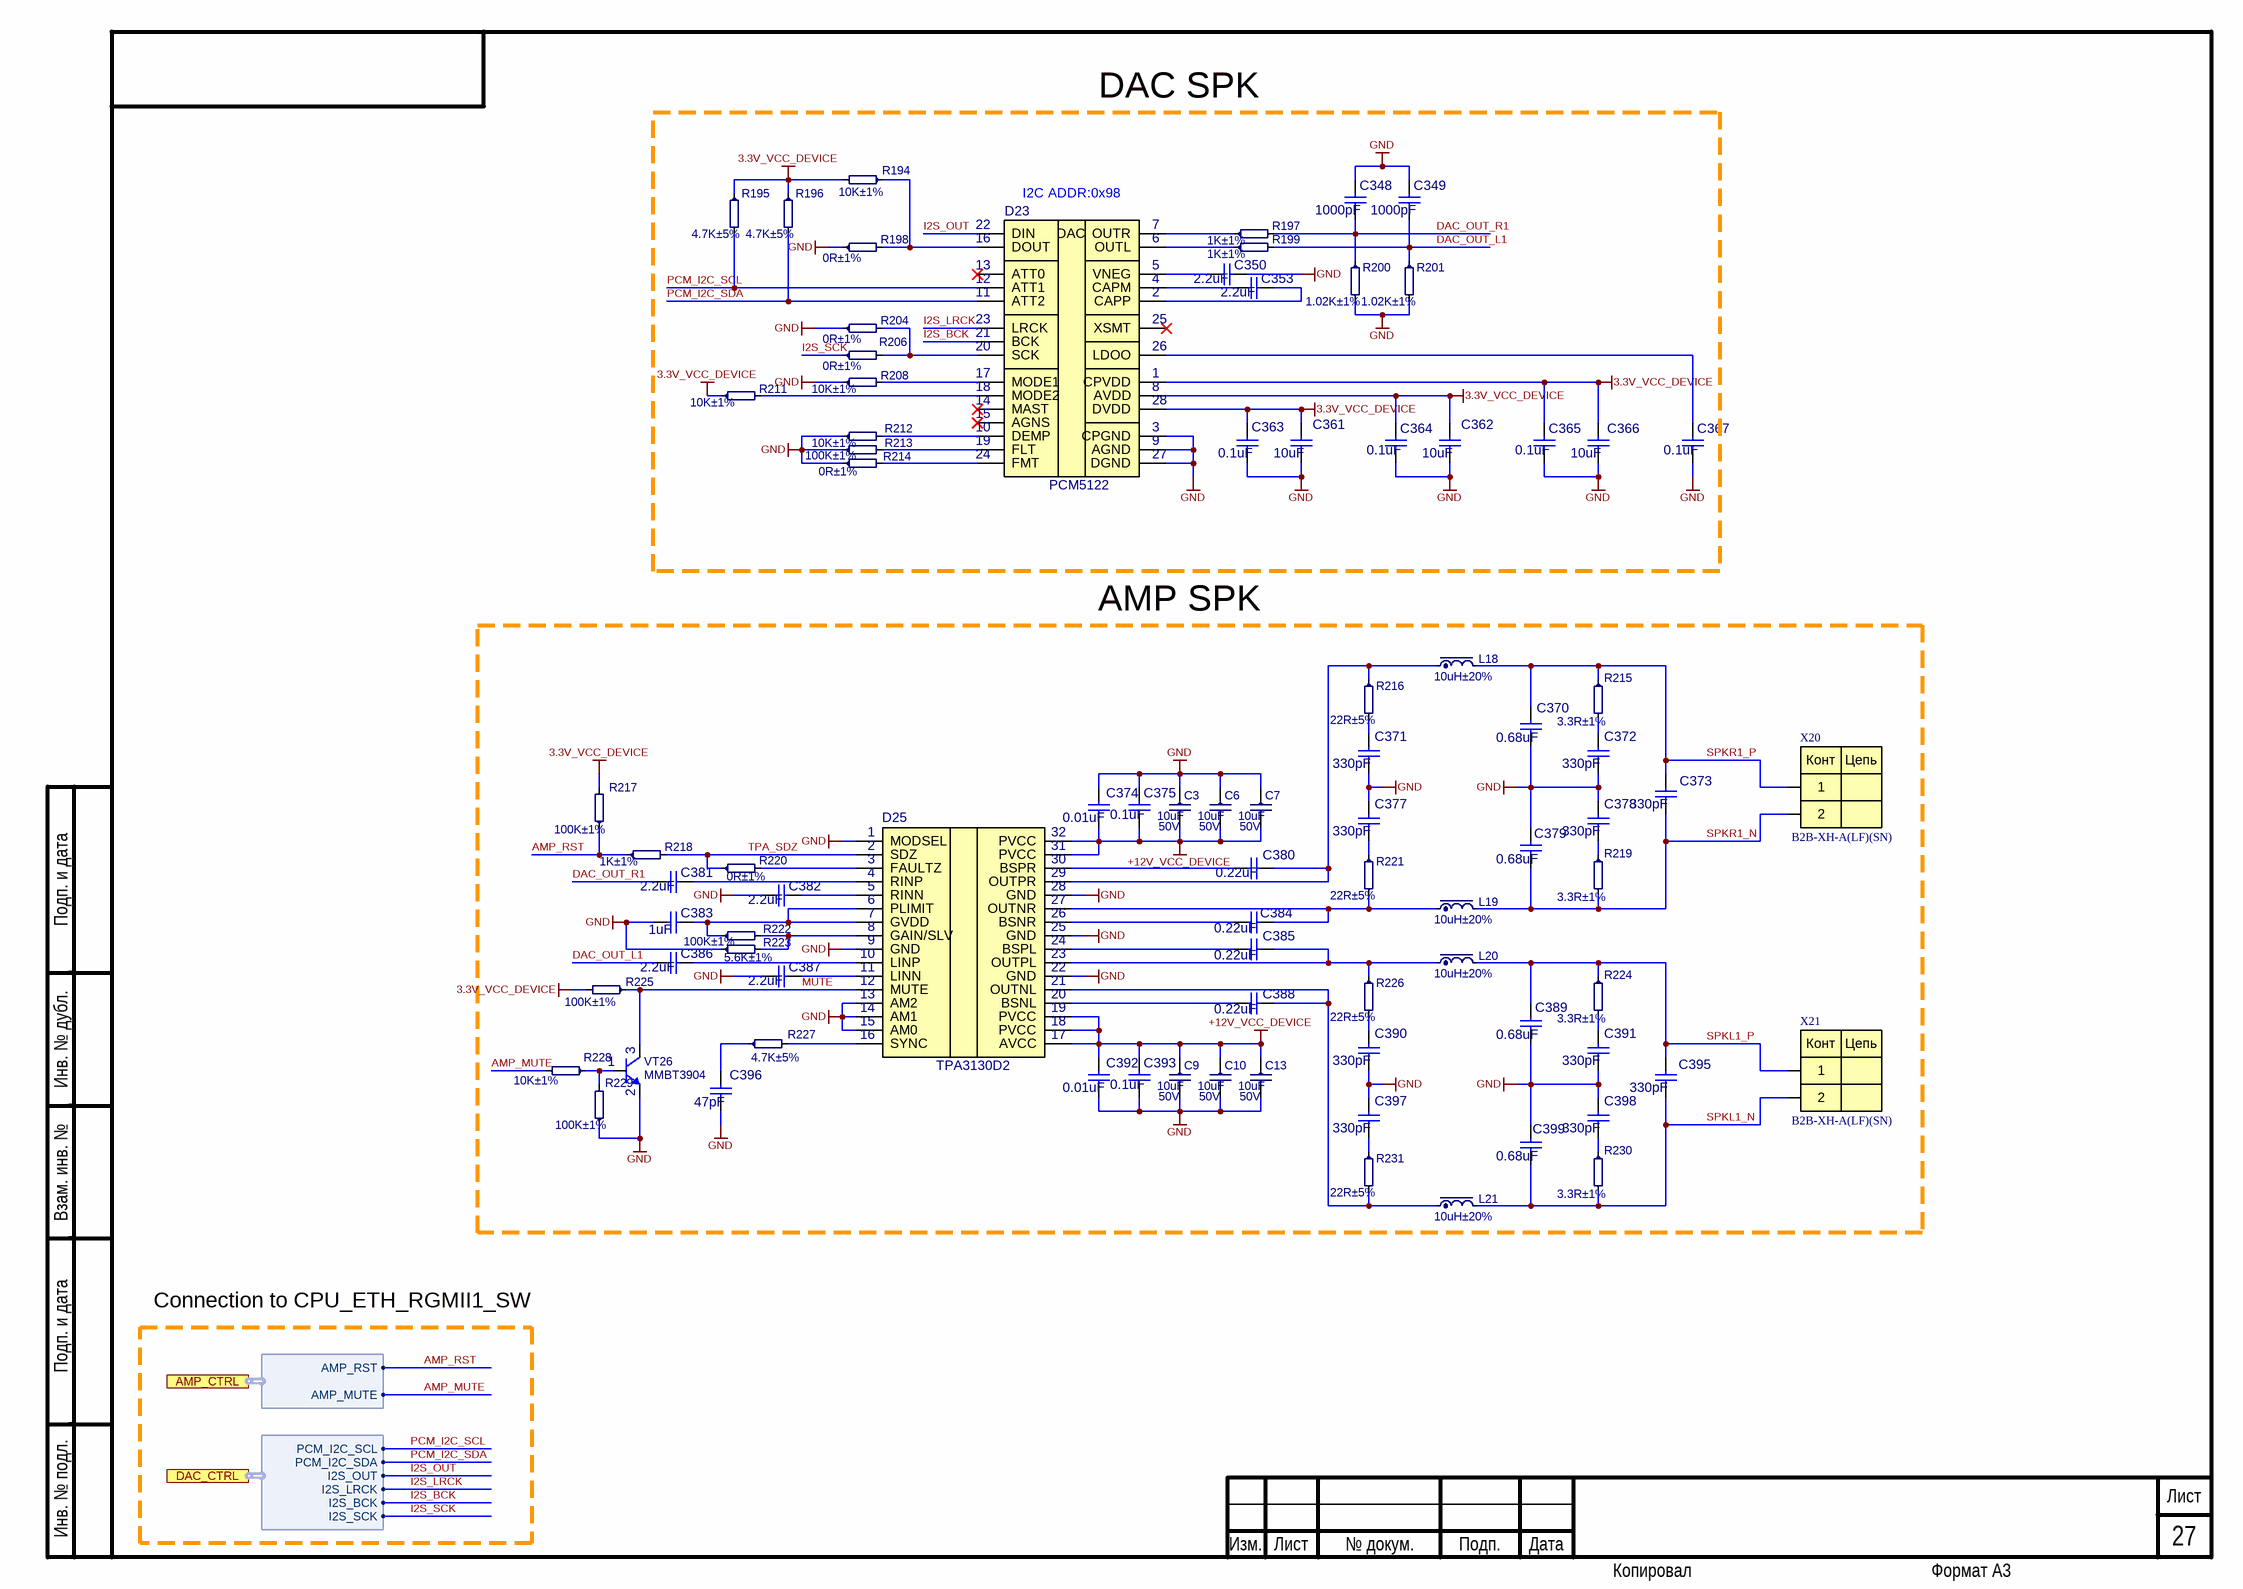
[diagram p18: AUDIO.SchDoc]

### Parts
C3  10uF  Voltage: 50V  [C1206]
C6  10uF  Voltage: 50V  [C1206]
C7  10uF  Voltage: 50V  [C1206]
C9  10uF  Voltage: 50V  [C1206]
C10  10uF  Voltage: 50V  [C1206]
C13  10uF  Voltage: 50V  [C1206]
C348  1000pF  [C0402]
C349  1000pF  [C0402]
C350  2.2uF  [C0402]
C353  2.2uF  [C0402]
C361  10uF  [C0603]
C362  10uF  [C0603]
C363  0.1uF  [C0402]
C364  0.1uF  [C0402]
C365  0.1uF  [C0402]
C366  10uF  [C0603]
C367  0.1uF  [C0402]
C370  0.68uF  [C0603]
C371  330pF  [C0603]
C372  330pF  [C0603]
C373  330pF  [C0603]
C374  0.01uF  [C0402]
C375  0.1uF  [C0402]
C377  330pF  [C0603]
C378  330pF  [C0603]
C379  0.68uF  [C0603]
C380  0.22uF  [C0603]
C381  2.2uF  [C0402]
C382  2.2uF  [C0402]
C383  1uF  [C0402]
C384  0.22uF  [C0603]
C385  0.22uF  [C0603]
C386  2.2uF  [C0402]
C387  2.2uF  [C0402]
C388  0.22uF  [C0603]
C389  0.68uF  [C0603]
C390  330pF  [C0603]
C391  330pF  [C0603]
C392  0.01uF  [C0402]
C393  0.1uF  [C0402]
C395  330pF  [C0603]
C396  47pF  [C0402]
C397  330pF  [C0603]
C398  330pF  [C0603]
C399  0.68uF  [C0603]
D23  PCM5122  [TSSOP65-28]
D25  TPA3130D2  [TSOP65P810X115-32M]
L18  10uH±20%  [MWSA0605S]
L19  10uH±20%  [MWSA0605S]
L20  10uH±20%  [MWSA0605S]
L21  10uH±20%  [MWSA0605S]
R194  10K±1%  [R0402]
R195  4.7K±5%  [R0402]
R196  4.7K±5%  [R0402]
R197  1K±1%  [R0402]
R198  0R±1%  [R0402]
R199  1K±1%  [R0402]
R200  1.02K±1%  [R0402]
R201  1.02K±1%  [R0402]
R204  0R±1%  [R0402]
R206  0R±1%  [R0402]
R208  10K±1%  [R0402]
R211  10K±1%  [R0402]
R212  10K±1%  [R0402]
R213  100K±1%  [R0402]
R214  0R±1%  [R0402]
R215  3.3R±1%  [R0603]
R216  22R±5%  [R0603]
R217  100K±1%  [R0402]
R218  1K±1%  [R0402]
R219  3.3R±1%  [R0603]
R220  0R±1%  [R0402]
R221  22R±5%  [R0603]
R222  100K±1%  [R0402]
R223  5.6K±1%  [R0402]
R224  3.3R±1%  [R0603]
R225  100K±1%  [R0402]
R226  22R±5%  [R0603]
R227  4.7K±5%  [R0402]
R228  10K±1%  [R0402]
R229  100K±1%  [R0402]
R230  3.3R±1%  [R0603]
R231  22R±5%  [R0603]
VT26  MMBT3904  [SOT23]
X20  B2B-XH-A(LF)(SN)  [B2B-XH-A(LF)(SN)]
X21  B2B-XH-A(LF)(SN)  [B2B-XH-A(LF)(SN)]

### Blocks framed on the sheet
I2C ADDR:0x98: C348-C350 C353 C361-C367 D23 R194-R201 R204 R206 R208 R211-R214

### Ports
AMP_CTRL (harness AMP_CTRL), DAC_CTRL (harness DAC_CTRL)

### Harnesses
AMP_CTRL: AMP_MUTE, AMP_RST
DAC_CTRL: PCM_I2C_SDA, PCM_I2C_SCL, I2S_OUT, I2S_LRCK, I2S_BCK, I2S_SCK

### Nets
3.3V_VCC_DEVICE: C361.2 C362.2 C363.2 C364.2 C365.2 C366.2 D23.1(CPVDD) D23.8(AVDD) D23.28(DVDD) R194.2 R195.1 R196.1 R211.1 R217.2 R225.2
+12V_VCC_DEVICE: C3.2 C6.2 C7.2 C9.1 C10.1 C13.1 C374.1 C375.1 C392.2 C393.2 D25.17(AVCC) D25.18(PVCC) D25.19(PVCC) D25.31(PVCC) D25.32(PVCC)
GND: C3.1 C6.1 C7.1 C9.2 C10.2 C13.2 C348.1 C349.1 C350.2 C361.1 C362.1 C363.1 C364.1 C365.1 C366.1 C367.1 C370.1 C371.1 C372.1 C374.2 C375.2 C377.2 C378.2 C379.2 C382.1 C383.2 C387.1 C389.1 C390.1 C391.1 C392.1 C393.1 C396.1 C397.2 C398.2 C399.2 D23.3(CPGND) D23.9(AGND) D23.27(DGND) D25.1(MODSEL) D25.9(GND) D25.13(AM2) D25.14(AM1) D25.15(AM0) D25.22(GND) D25.25(GND) D25.28(GND) R198.1 R200.2 R201.2 R204.1 R208.1 R212.1 R213.1 R214.1 R223.1 R229.1 VT26.2(E)
AMP_MUTE: R228.2 ; port AMP_CTRL.AMP_MUTE  [project net AMP_CTRL.AMP_MUTE]
AMP_RST: R217.1 R218.1 ; port AMP_CTRL.AMP_RST  [project net AMP_CTRL.AMP_RST]
DAC_OUT_L1: C349.2 C386.1 R199.2 R201.1
DAC_OUT_R1: C348.2 C381.1 R197.2 R200.1
I2S_BCK: D23.21(BCK) ; port DAC_CTRL.I2S_BCK  [project net DAC_CTRL.I2S_BCK]
I2S_LRCK: D23.23(LRCK) ; port DAC_CTRL.I2S_LRCK  [project net DAC_CTRL.I2S_LRCK]
I2S_OUT: D23.22(DIN) ; port DAC_CTRL.I2S_OUT  [project net DAC_CTRL.I2S_OUT]
I2S_SCK: R206.1 ; port DAC_CTRL.I2S_SCK  [project net DAC_CTRL.I2S_SCK]
MUTE: D25.12(MUTE) R225.1 VT26.3(C)
PCM_I2C_SCL: D23.12(ATT1) R195.2 ; port DAC_CTRL.PCM_I2C_SCL  [project net DAC_CTRL.PCM_I2C_SCL]
PCM_I2C_SDA: D23.11(ATT2) R196.2 ; port DAC_CTRL.PCM_I2C_SDA  [project net DAC_CTRL.PCM_I2C_SDA]
SPKL1_N: C395.1 C399.1 L21.2 R230.2 X21.2
SPKL1_P: C389.2 C395.2 L20.2 R224.1 X21.1
SPKR1_N: C373.1 C379.1 L19.2 R219.2 X20.2
SPKR1_P: C370.2 C373.2 L18.2 R215.1 X20.1
TPA_SDZ: D25.2(SDZ) R218.2 R220.1
NetC350_1: C350.1 D23.5(VNEG)
NetC353_1: C353.1 D23.4(CAPM)
NetC353_2: C353.2 D23.2(CAPP)
NetC367_2: C367.2 D23.26(LDOO)
NetC371_2: C371.2 R216.2
NetC372_2: C372.2 R215.2
NetC377_1: C377.1 R221.1
NetC378_1: C378.1 R219.1
NetC380_1: C380.1 D25.30(BSPR)
NetC380_2: C380.2 D25.29(OUTPR) L18.1 R216.1
NetC381_2: C381.2 D25.4(RINP)
NetC382_2: C382.2 D25.5(RINN)
NetC383_1: C383.1 D25.6(PLIMIT) D25.7(GVDD) R222.1
NetC384_1: C384.1 D25.26(BSNR)
NetC384_2: C384.2 D25.27(OUTNR) L19.1 R221.2
NetC385_1: C385.1 D25.24(BSPL)
NetC385_2: C385.2 D25.23(OUTPL) L20.1 R226.1
NetC386_2: C386.2 D25.10(LINP)
NetC387_2: C387.2 D25.11(LINN)
NetC388_1: C388.1 D25.20(BSNL)
NetC388_2: C388.2 D25.21(OUTNL) L21.1 R231.2
NetC390_2: C390.2 R226.2
NetC391_2: C391.2 R224.2
NetC396_2: C396.2 R227.1
NetC397_1: C397.1 R231.1
NetC398_1: C398.1 R230.1
NetD23_6: D23.6(OUTL) R199.1
NetD23_7: D23.7(OUTR) R197.1
NetD23_10: D23.10(DEMP) R212.2
NetD23_16: D23.16(DOUT) R194.1 R198.2
NetD23_17: D23.17(MODE1) R208.2
NetD23_18: D23.18(MODE2) R211.2
NetD23_19: D23.19(FLT) R213.2
NetD23_20: D23.20(SCK) R204.2 R206.2
NetD23_24: D23.24(FMT) R214.2
NetD25_3: D25.3(FAULTZ) R220.2
NetD25_8: D25.8(GAIN/SLV) R222.2 R223.2
NetD25_16: D25.16(SYNC) R227.2
NetR228_1: R228.1 R229.2 VT26.1(B)

Not connected (* = marked no-connect by the designer): D23 13(ATT0)* 14(MAST)* 15(AGNS)* 25(XSMT)*

### Notes on the sheet
- DAC SPK
- AMP SPK
- Connection to CPU_ETH_RGMII1_SW
- Подп. и дата
- Инв. № дубл.
- Взам. инв. №
- Инв. № подл.
- Изм.
- Лист
- № докум.
- Подп.
- Дата
- Копировал
- Формат А3
- (in symbol B2B-XH-A(LF)(SN)) Конт; Цепь
- (in symbol PCM5121) DAC

### Library data of the parts
C3 C6 C7 C9 C10 C13 = 1206-X5R-50V-010uF±10%: Manufacturer: Yageo; NameFromManufacturer: CC1206KKX5R9BB106; Dielectric: X5R; Place: *); Tolerance: 10%; Check: False; Case: C1206; Part Number: 1206-X5R-50V-010uF±10%; Value: 10uF; Temperature: -55°C~85°C; ComponentLink2Description: Link to datasheet; ComponentLink1Description: DATASHEET; ComponentLink2URL: https://www.terraelectronica.ru/product/2097656; ComponentLink1URL: Datasheets/capacitors/UPY-GPHC_X5R_4V-to-50V_27.pdf; Last changed: 27.10.2022
C348 C349 = 0402-X7R-50V-1000pF±5%: Manufacturer: Yageo; NameFromManufacturer: CC0402JRX7R9BB102; Place: S; Voltage: 50V; Tolerance: 5%; Check: False; Part Number: 0402-X7R-50V-1000pF±5%; Value: 1000pF; Temperature: -55°C~125°C; ComponentLink1Description: DATASHEET; ComponentLink1URL: https://ru.mouser.com/ProductDetail/YAGEO/CC0402JRX7R9BB102?qs=%2Fha2pyFadugad28DmURO4b2qvKgXCEL3EHEIBaCV%252BxrO6dOD1PZ5Bw%3D%3D; Datasheet: #https://www.yageo.com/upload/media/product/productsearch/datasheet/mlcc/UPY-GPHC_X7R_6.3V-to-50V_20.pdf#; Last changed: 07.10.2021
C350 C353 C381 C382 C386 C387 = 0402-X5R-16V-2.2uF±10%: *; Manufacturer: Yageo; NameFromManufacturer: CC0402KRX5R7BB225; Place: S; Voltage: 16V; Tolerance: 10%; Check: False; Part Number: 0402-X5R-16V-2.2uF±10%; Value: 2.2uF; Temperature: -55°C~85°C; ComponentLink1Description: DATASHEET; ComponentLink1URL: https://www.terraelectronica.ru/product/2082992; Datasheet: #https://www.yageo.com/upload/media/product/productsearch/datasheet/mlcc/UPY-GPHC_X5R_4V-to-50V_27.pdf#; Last changed: 23.08.2022
C361 C362 C366 = 0603-X5R-10V-10uF±20%: *; Manufacturer: Samsung Electro-Mechanics; NameFromManufacturer: CL10A106MP8NNNC; Place: S; Voltage: 10V; Tolerance: 20%; Check: False; Part Number: 0603-X5R-10V-10uF±20%; Value: 10uF; Temperature: -55°C~85°C; ComponentLink1Description: DATASHEET; ComponentLink1URL: https://www.terraelectronica.ru/product/863287; Datasheet: #https://www.terraelectronica.ru/pdf/show?pdf_file=http%253A%252F%252Fwww.farnell.com%252Fdatasheets%252F2710660.pdf#; Last changed: 30.08.2022
C363-C365 C367 C375 C393 = 0402-X5R-50V-0.1uF±10%: Manufacturer: Yageo; NameFromManufacturer: CC0402KRX5R9BB104; Place: S; Voltage: 50V; Tolerance: 10%; Check: False; Part Number: 0402-X5R-50V-0.1uF±10%; Value: 0.1uF; Temperature: -55°C~85°C; ComponentLink1Description: DATASHEET; ComponentLink1URL: https://www.yageo.com/upload/media/product/productsearch/datasheet/mlcc/UPY-GPHC_X5R_4V-to-50V_26.pdf; Datasheet: #https://www.yageo.com/upload/media/product/productsearch/datasheet/mlcc/UPY-GPHC_X5R_4V-to-50V_26.pdf#; Last changed: 16.01.2022
C370 C379 C389 C399 = 0603-X7R-25V-0.68uF±10%: Manufacturer: Yageo; NameFromManufacturer: CC0603KRX7R8BB684; Place: S; Voltage: 25V; Tolerance: 10%; Check: False; Part Number: 0603-X7R-25V-0.68uF±10%; Value: 0.68uF; Temperature: -55°C~125°C; ComponentLink1Description: DATASHEET; ComponentLink1URL: https://lcsc.com/product-detail/Multilayer-Ceramic-Capacitors-MLCC-SMD-SMT_YAGEO-CC0603KRX7R8BB684_C2838708.html; Datasheet: #https://www.yageo.com/upload/media/product/productsearch/datasheet/mlcc/UPY-GPHC_X7R_6.3V-to-50V_20.pdf#; Last changed: 22.08.2022
C371-C373 C377 C378 C390 C391 C395 C397 C398 = 0603-NP0-50V-330pF±5%: *; Manufacturer: Yageo; NameFromManufacturer: CC0603JRNPO9BN331; Place: S; Voltage: 50V; Tolerance: 5%; Check: False; Part Number: 0603-NP0-50V-330pF±5%; Value: 330pF; Temperature: -55°C~125°C; ComponentLink1Description: DATASHEET; ComponentLink1URL: https://www.terraelectronica.ru/product/709596; Datasheet: #https://www.yageo.com/upload/media/product/productsearch/datasheet/mlcc/UPY-GP_NP0_16V-to-50V_18.pdf#; Last changed: 23.08.2022
C374 C392 = 0402-X7R-50V-0.01uF±10%: Manufacturer: Yageo; NameFromManufacturer: CC0402KRX7R9BB103; Place: S; Voltage: 50V; Tolerance: 10%; Check: False; Annotation: *; Param: *; Value: 0.01uF; Part Number: 0402-X7R-50V-0.01uF±10%; Temperature: -55°C~125°C; ComponentLink1Description: DATASHEET; ComponentLink1URL: https://www.terraelectronica.ru/pdf/show?pdf_file=%252Fds%252Fpdf%252FX%252FX7R_16V-to-100V.pdf; Datasheet: #https://www.terraelectronica.ru/pdf/show?pdf_file=%252Fds%252Fpdf%252FX%252FX7R_16V-to-100V.pdf#; Last changed: 17.05.2021
C380 C384 C385 C388 = 0603-X7R-50V-0.22uF±10%: Part Number: 0603-X5R-50V-0.22uF±10%; Manufacturer: Samsung; NameFromManufacturer: CL10A224KB8NNNC; Place: S; Voltage: 50V; Tolerance: 10%; Check: False; Value: 0.22uF; Temperature: -55°C~125°C; ComponentLink1Description: DATASHEET; ComponentLink1URL: https://www.terraelectronica.ru/product/1045441; Datasheet: #https://www.yageo.com/upload/media/product/productsearch/datasheet/mlcc/UPY-GPHC_X7R_6.3V-to-50V_20.pdf#; Last changed: 18.01.2022
C383 = 0402-X5R-10V-1uF±10%: Manufacturer: Samsung; NameFromManufacturer: CL05A105KP5NNNC; Place: S; Voltage: 10V; Tolerance: 10%; Check: False; Part Number: 0402-X5R-10V-1uF±10%; Value: 1uF; Temperature: -55°C~85°C; ComponentLink1Description: DATASHEET; ComponentLink1URL: https://datasheet.ciiva.com/15195/getdatasheetpartid-358390-15195630.pdf?src-supplier=Verical; Datasheet: #https://datasheet.ciiva.com/15195/getdatasheetpartid-358390-15195630.pdf?src-supplier=Verical#; Last changed: 04.04.2021
C396 = 0402-NP0-50V-047pF±5%: Manufacturer: Yageo; NameFromManufacturer: CC0402JRNPO9BN470; Place: S; Voltage: 50V; Tolerance: 5%; Check: False; Part Number: 0402-NP0-50V-047pF±5%; Value: 47pF; Temperature: -55°C~125°C; ComponentLink1Description: DATASHEET; ComponentLink1URL: https://www.terraelectronica.ru/product/567824; Datasheet: #https://www.yageo.com/upload/media/product/productsearch/datasheet/mlcc/UPY-GP_NP0_16V-to-50V_18.pdf#; Last changed: 30.08.2022
D23 = PCM5121: 2V RMS DIRECTPATH 106dB Audio Stereo DAC with PCM interface and fixed Audio processing; Manufacturer: Texas Instruments; Place: S; Check: False; Annotation: *; Param: *; Part Number: PCM5122; Temperature: -40°C~130°C; Value: PCM5122; ComponentLink1Description: DATASHEET; NameFromManufacturer: PCM5122; ComponentLink1URL: https://www.chipdip.ru/product0/8002050004; Datasheet: #https://www.ti.com/lit/ds/symlink/pcm5121.pdf?ts=1649018753254&ref_url=https%253A%252F%252Fwww.ti.com%252Fproduct%252FPCM5121#; Last changed: 04.04.2022
D25 = TPA3130D2: TPA3130D2 Evaluation Module; Manufacturer: Texas Instruments; Place: S; Check: False; Part Number: TPA3130D2; Temperature: -40°C~85°C; Value: TPA3130D2; ComponentLink1Description: DATASHEET; NameFromManufacturer: TPA3130D2; ComponentLink1URL: https://octopart.com/tpa3130d2evm-texas+instruments-22881734?r=sp; Datasheet: #https://www.ti.com/lit/ds/slos708g/slos708g.pdf?ts=1627825887126&ref_url=https%253A%252F%252Fwww.ti.com%252Fproduct%252FTPA3116D2#; Last changed: 02.08.2021
L18-L21 = MWSA0605S-100MT: 4.4A 10uH ±20% 4.5A SMD 7x6.6mm Power Inductor; Manufacturer: Sunlord; Place: *); DC Resistance: 0.06R; Check: False; Current: 4.5A; Case: MWSA0605S; Part Number: MWSA0605S-100MT; Value: 10uH; Tolerance: 20%; Temperature: -40°C~125°C; ComponentLink1Description: DATASHEET; NameFromManufacturer: MWSA0605S-100MT; ComponentLink1URL: https://www.electronshik.ru/search?query=MWSA0605S-100MT; Last changed: 17.07.2025
R194 R208 R211 R212 R228 = 0402-0.0625W-10K-100ppm±1%: as R93 on sheet USB; Case: R0402; Part Number: 0402-0.0625W-10K-100ppm±1%; Tolerance: 1%; Temperature: -55°C~155°C; ComponentLink1Description: DATASHEET; ComponentLink1URL: https://ru.mouser.com/ProductDetail/YAGEO/RC0402FR-0710KL?qs=%2Fha2pyFaduhjtLcYvKXQ8IogF7YwN7YtH%252BOO8ZtEEMnoa4yoWYcwpw%3D%3D; Datasheet: Datasheets/resistors/PYu-RC_Group_51_RoHS_L_11.pdf; Last changed: 27.10.2022
R195 R196 R227 = 0402-0.0625W-4.7K-100ppm±5%: NameFromManufacturer: RC0402JR-074K7L; Manufacturer: Yageo; Place: *); Value: 4.7K; Tolerance: 5%; Check: False; Case: R0402; Part Number: 0402-0.0625W-4.7K-100ppm±5%; Temperature: -55°C~155°C; ComponentLink1Description: DATASHEET; ComponentLink1URL: https://ru.mouser.com/ProductDetail/YAGEO/RC0402JR-074K7L?qs=%2Fha2pyFadugNN0LzwXn2qDR0lAGI9qruexMTkPBFwcD9DqmvUvet2g%3D%3D; Datasheet: Datasheets/resistors/PYu-RC_Group_51_RoHS_L_11.pdf; Last changed: 27.10.2022
R197 R199 R218 = 0402-0.0625W-1K-100ppm±1%: NameFromManufacturer: RC0402FR-071KL; Manufacturer: Yageo; Place: *); Value: 1K; Tolerance: 1%; Check: False; Case: R0402; Part Number: 0402-0.0625W-1K-100ppm±1%; Temperature: -55°C~155°C; ComponentLink1Description: DATASHEET; ComponentLink1URL: https://ru.mouser.com/datasheet/2/447/PYu_RC_Group_51_RoHS_L_10-1664068.pdf; Datasheet: Datasheets/resistors/PYu_RC_Group_51_RoHS_L_10-1664068.pdf; Last changed: 27.10.2022
R198 R204 R206 R214 R220 = 0402-0.0625W-0R-100ppm±1%: Chip Resistor 0402 0Ω ±1% 50V ±100ppm/℃ Thick Film; NameFromManufacturer: RC0402FR-070RL; Manufacturer: Yageo; Place: *); Value: 0R; Check: False; Case: R0402; Part Number: 0402-0.0625W-0R-100ppm±1%; Tolerance: 1%; Temperature: -55°C~155°C; ComponentLink1Description: DATASHEET; ComponentLink1URL: https://www.chipdip.ru/product0/8000617426?ysclid=l7og5x0plo427794326; Datasheet: Datasheets/resistors/DOC012445956.pdf; Last changed: 27.10.2022
R200 R201 = 0402-0.0625W-1.02K-100ppm±1%: NameFromManufacturer: RC0402FR-071K02L; Manufacturer: Yageo; Place: *); Value: 1.02K; Tolerance: 1%; Check: False; Case: R0402; Part Number: 0402-0.0625W-1.02K-100ppm±1%; Temperature: -55°C~155°C; ComponentLink1Description: DATASHEET; ComponentLink1URL: https://www.terraelectronica.ru/product/876888; Datasheet: Datasheets/resistors/PYu-RC_Group_51_RoHS_L_12.pdf; Last changed: 27.10.2022
R213 R217 R222 R225 R229 = 0402-0.0625W-100K-100ppm±1%: as R92 on sheet USB; Case: R0402; Part Number: 0402-0.0625W-100K-100ppm±1%; Tolerance: 1%; Temperature: -55°C~155°C; ComponentLink1Description: DATASHEET; ComponentLink1URL: https://www.yageo.com/upload/media/product/productsearch/datasheet/rchip/PYu-RC_Group_51_RoHS_L_11.pdf; Datasheet: Datasheets/resistors/PYu-RC_Group_51_RoHS_L_11.pdf; Last changed: 27.10.2022
R215 R219 R224 R230 = 0603-0.1W-3.3R-200ppm±1%: *; NameFromManufacturer: RC0603FR-073R3L; Manufacturer: Yageo; Place: *); Value: 3.3R; Tolerance: 1%; Check: False; Case: R0603; Part Number: 0603-0.1W-3.3R-200ppm±1%; Temperature: -55°C~155°C; ComponentLink1Description: DATASHEET; ComponentLink1URL: https://www.terraelectronica.ru/product/871121; Datasheet: Datasheets/resistors/PYu-RC_Group_51_RoHS_L_12.pdf; Last changed: 27.10.2022
R216 R221 R226 R231 = 0603-0.1W-22R-100ppm±5%: NameFromManufacturer: RC0603JR-0722RL; Manufacturer: Yageo; Place: *); Value: 22R; Tolerance: 5%; Check: False; Case: R0603; Part Number: 0603-0.1W-22R-100ppm±5%; Temperature: -55°C~155°C; ComponentLink1Description: DATASHEET; ComponentLink1URL: https://www.terraelectronica.ru/product/328449; Datasheet: Datasheets/resistors/PYu-RC_Group_51_RoHS_L_12.pdf; Last changed: 27.10.2022
R223 = 0402-0.0625W-5.6K-100ppm±1%: *; NameFromManufacturer: RC0402FR-075K6L; Manufacturer: Yageo; Place: *); Value: 5.6K; Tolerance: 1%; Check: False; Case: R0402; Part Number: 0402-0.0625W-5.6K-100ppm±1%; Temperature: -40°C~155°C; ComponentLink1Description: DATASHEET; ComponentLink1URL: https://www.terraelectronica.ru/product/361844; Datasheet: Datasheets/resistors/PYu-RC_Group_51_RoHS_L_12.pdf; Last changed: 27.10.2022
VT26 = MMBT3904: NPN transistor; Manufacturer: Diotec Semiconductor; Place: S; Voltage: 40V; Check: False; Part Number: MMBT3904; Value: MMBT3904; Temperature: -55°C~150°C; ComponentLink1Description: DATASHEET; NameFromManufacturer: MMBT3904; ComponentLink1URL: https://www.terraelectronica.ru/product/607582; Datasheet: #https://diotec.com/request/datasheet/mmbt3904.pdf#; Last changeв: 01.09.2022
X20 X21 = B2B-XH-A(LF)(SN): Connector Header 2 position 2.5mm Pitch 3A Through Hole -25℃~+85℃; Manufacturer: JST; Check: False; Value: B2B-XH-A(LF)(SN); Availability: Unavailable; Price: None; Package: None; MP: B2B-XH-A(LF)(SN); Part Number: B2B-XH-A(LF)(SN); NameFromManufacturer: B2B-XH-A(LF)(SN)